# Altium schematic sheet 02_LoRaE5_MCU.SchDoc
size A4; SheetNumber: 4; SheetTotal: 6
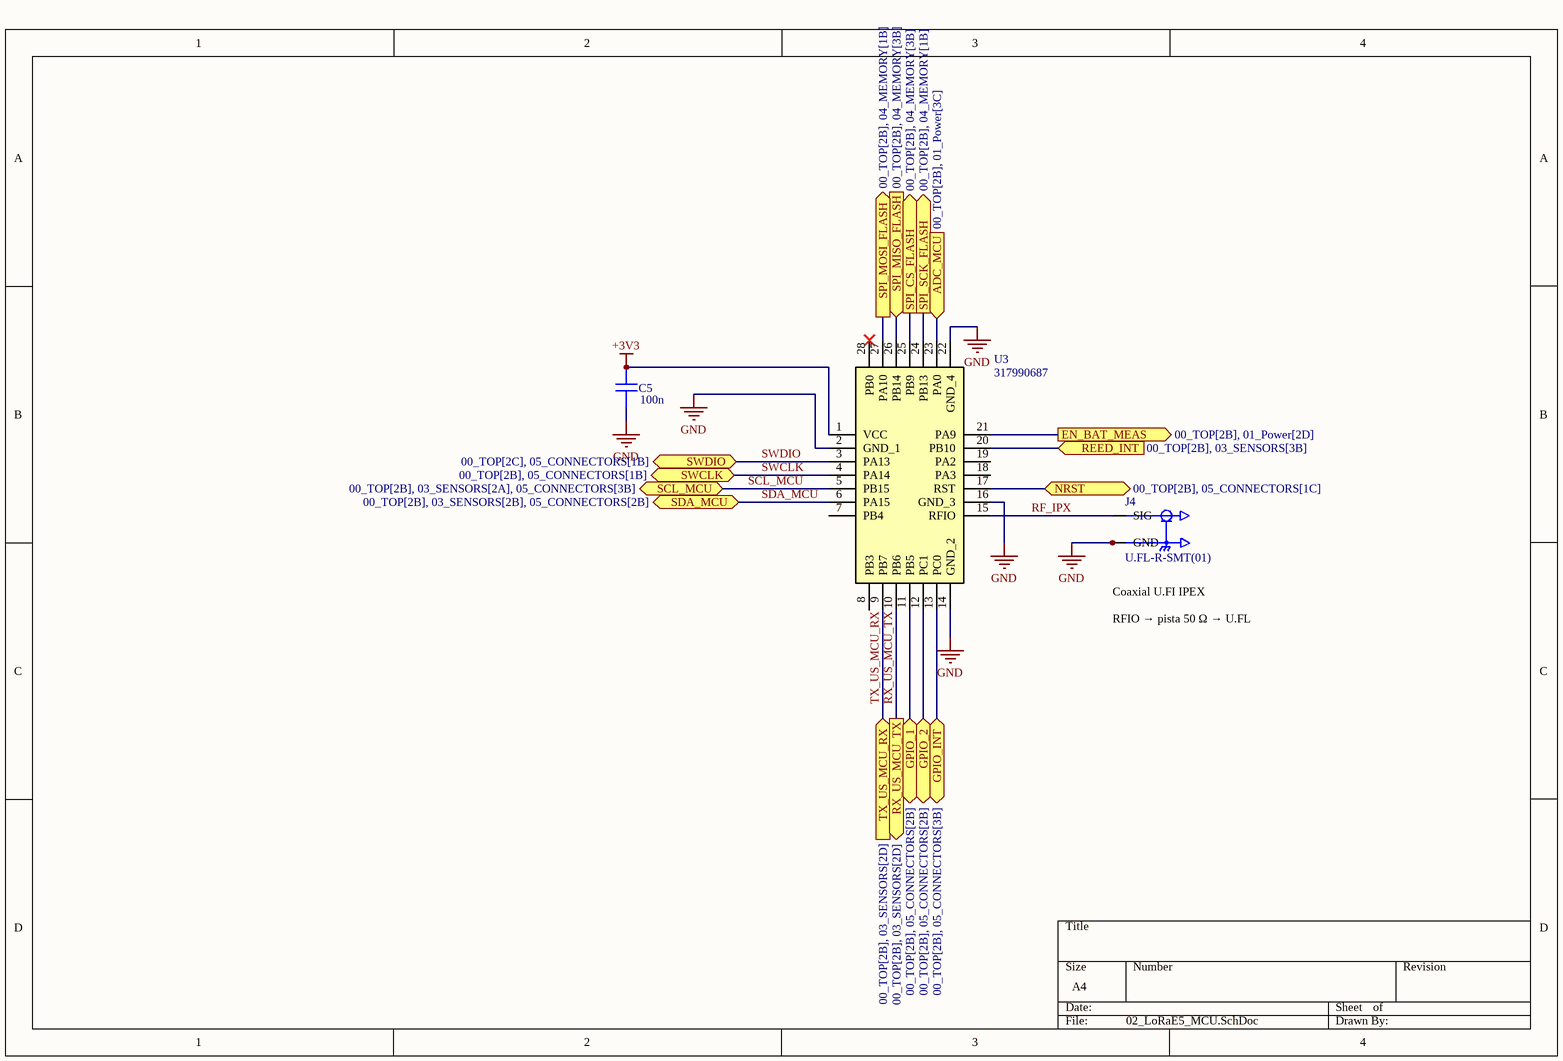
[diagram p0: 02_LoRaE5_MCU.SchDoc]

## Parts
C5  100n  [Capacitor_SMD:0603_1608m]
J4  U.FL-R-SMT(01)  [U.FL-R-SMT(01)]
U3  317990687  [317990687]

## Ports
ADC_MCU (in, see 00_TOP[2B], 01_Power[3C]), EN_BAT_MEAS (out, see 00_TOP[2B], 01_Power[2D]), GPIO_1 (bidir, see 00_TOP[2B], 05_CONNECTORS[2B]), GPIO_2 (bidir, see 00_TOP[2B], 05_CONNECTORS[2B]), GPIO_INT (bidir, see 00_TOP[2B], 05_CONNECTORS[3B]), NRST (bidir, see 00_TOP[2B], 05_CONNECTORS[1C]), REED_INT (in, see 00_TOP[2B], 03_SENSORS[3B]), RX_US_MCU_TX (out, see 00_TOP[2B], 03_SENSORS[2D]), SCL_MCU (bidir, see 00_TOP[2B], 03_SENSORS[2A], 05_CONNECTORS[3B]), SDA_MCU (bidir, see 00_TOP[2B], 03_SENSORS[2B], 05_CONNECTORS[2B]), SPI_CS_FLASH (out, see 00_TOP[2B], 04_MEMORY[3B]), SPI_MISO_FLASH (in, see 00_TOP[2B], 04_MEMORY[3B]), SPI_MOSI_FLASH (out, see 00_TOP[2B], 04_MEMORY[1B]), SPI_SCK_FLASH (out, see 00_TOP[2B], 04_MEMORY[1B]), SWCLK (bidir, see 00_TOP[2B], 05_CONNECTORS[1B]), SWDIO (bidir, see 00_TOP[2C], 05_CONNECTORS[1B]), TX_US_MCU_RX (in, see 00_TOP[2B], 03_SENSORS[2D])

## Nets
+3V3: C5.1 U3.1(VCC)
GND: C5.2 J4.1(GND) J4.2(GND) U3.2(GND_1) U3.14(GND_2) U3.16(GND_3) U3.22(GND_4)
ADC_MCU: U3.23(PA0) ; port ADC_MCU
EN_BAT_MEAS: U3.21(PA9) ; port EN_BAT_MEAS
GPIO_1: U3.11(PB5) ; port GPIO_1
GPIO_2: U3.12(PC1) ; port GPIO_2
GPIO_INT: U3.13(PC0) ; port GPIO_INT
NRST: U3.17(RST) ; port NRST
REED_INT: U3.20(PB10) ; port REED_INT
RF_IPX: J4.3(SIG) U3.15(RFIO)
RX_US_MCU_TX: U3.10(PB6) ; port RX_US_MCU_TX
SCL_MCU: U3.5(PB15) ; port SCL_MCU
SDA_MCU: U3.6(PA15) ; port SDA_MCU
SPI_CS_FLASH: U3.25(PB9) ; port SPI_CS_FLASH
SPI_MISO_FLASH: U3.26(PB14) ; port SPI_MISO_FLASH
SPI_MOSI_FLASH: U3.27(PA10) ; port SPI_MOSI_FLASH
SPI_SCK_FLASH: U3.24(PB13) ; port SPI_SCK_FLASH
SWCLK: U3.4(PA14) ; port SWCLK
SWDIO: U3.3(PA13) ; port SWDIO
TX_US_MCU_RX: U3.9(PB7) ; port TX_US_MCU_RX

Not connected (* = marked no-connect by the designer): U3 7(PB4) 8(PB3) 18(PA3) 19(PA2) 28(PB0)*

## Notes on the sheet
- (near J4) Coaxial U.FI IPEX
- RFIO → pista 50 Ω → U.FL

## Library data of the parts
C5 = Generic_Capacitor
J4 = U.FL-R-SMT(01): MF: Hirose; Check_prices: https://www.snapeda.com/parts/U.FL-R-SMT(01)/Hirose+Electric+Co+Ltd/view-part/?ref=eda; Value: *; Availability: In Stock; MP: U.FL-R-SMT(01); Price: None; Package: None; SnapEDA_Link: https://www.snapeda.com/parts/U.FL-R-SMT(01)/Hirose+Electric+Co+Ltd/view-part/?ref=snap; Purchase-URL: https://pricing.snapeda.com/search/part/U.FL-R-SMT(01)/?ref=eda